# EAGLE schematic Ticking Sound Generator (EAGLE 9.6.2)
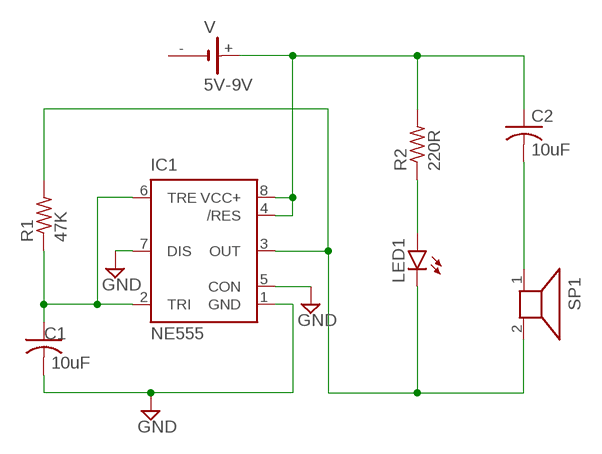
[diagram p0: schematic, sheet 1]

## Parts
C1  10uF  C-US025-024X044  [C025-024X044]
C2  10uF  C-US025-024X044  [C025-024X044]
IC1  NE555  [DIL-08]
LED1  LAP4-BOTTOM  [P47F-BOTTOM]
R1  47K  R-US_0204/7  [0204/7]
R2  220R  R-US_0204/7  [0204/7]
SP1  AL23P  [AL23P]
V  5V-9V  SL-150-1/2AA/PT  [SL-150-1/2AA/PT]

## Nets
GND: C1.2 IC1.1(GND) IC1.5(CON) IC1.7(DIS)
N$1: C2.1 IC1.4(/RES) IC1.8(VCC+) R2.2 V.+
N$2: LED1.A R2.1
N$3: IC1.3(OUT) LED1.C R1.2 SP1.2
N$5: C2.2 SP1.1
N$7: C1.1 IC1.2(TRI) IC1.6(TRE) R1.1
Unconnected: V.- V.-@1(-)

## Library data of the parts
C1 = rcl:C-US: CAPACITOR, American symbol; SPICEPREFIX: C1
C2 = rcl:C-US: CAPACITOR, American symbol; SPICEPREFIX: C
IC1 = st-microelectronics:NE555: General purpose bipolar Timer; MF: Arrow Electronics; MPN: NE555N; OC_FARNELL: 1467742; OC_NEWARK: 89K1486
LED1 = led:*P4: PointLED® Enhanced Thinfilm LED TOP & BOTTOM mount LS P47F, LR P47F, LA P47F, LY P47F, LT P4SG, LB P4SG, LW P4SG Source: http://catalog.osram-os.com .. LA_LR_LS_LY_P47F_Pb_free.pdf
R1 R2 = rcl:R-US_: RESISTOR, American symbol; SPICEPREFIX: R
SP1 = buzzer:AL23P: SPEAKER Source: Buerklin; OC_FARNELL: unknown; OC_NEWARK: unknown
V = battery:SL-150-1/2AA/PT: LI BATTERY Sonnenschein